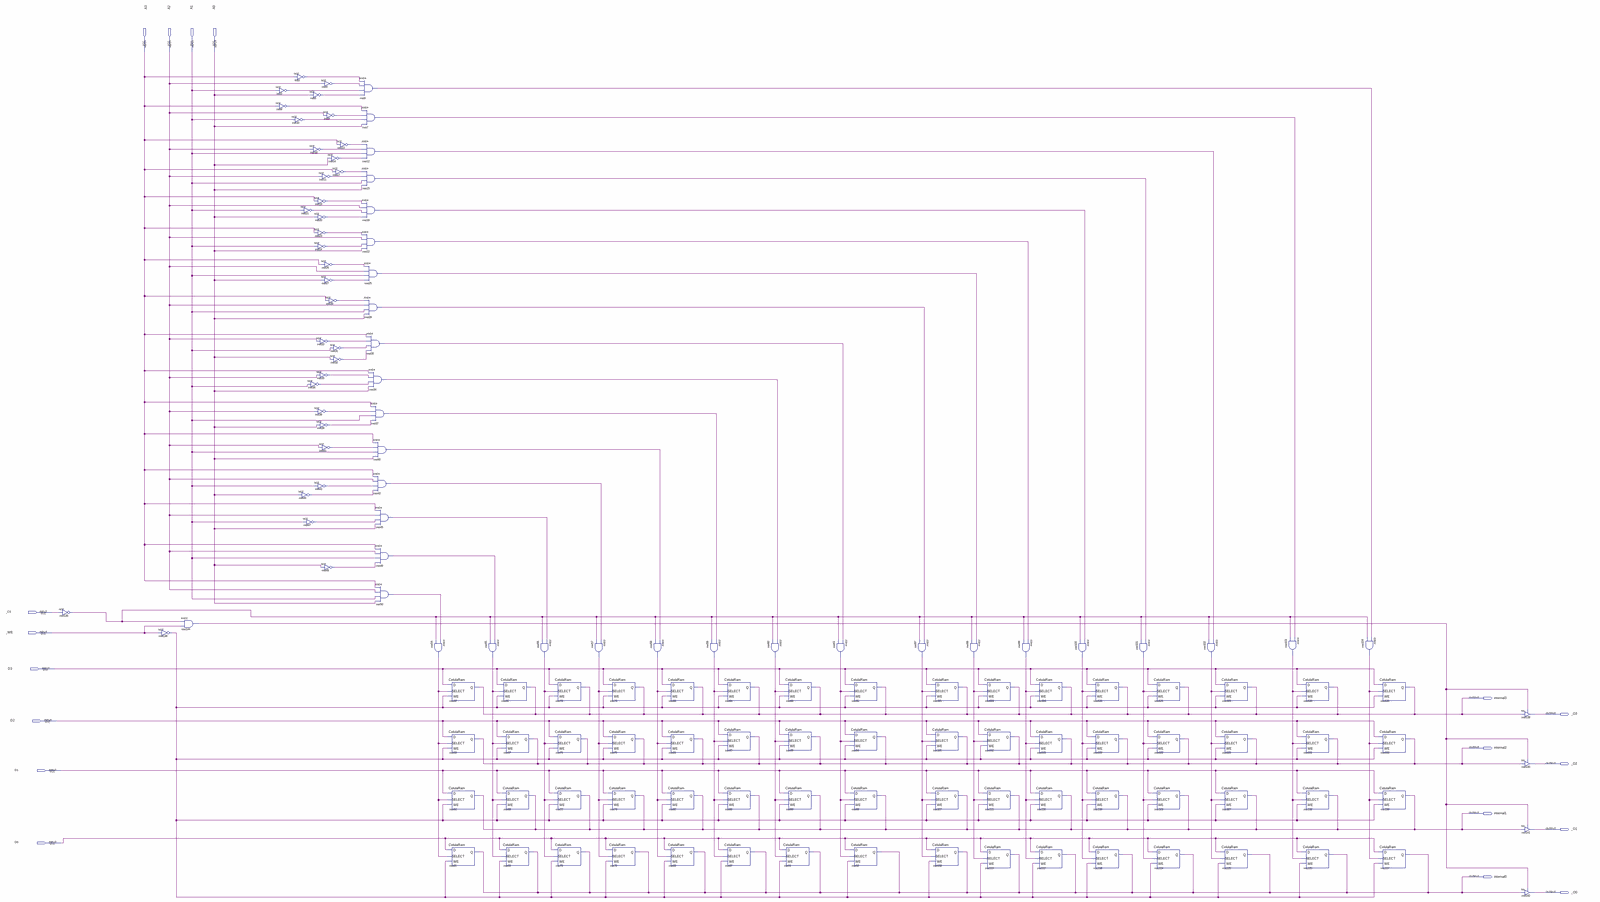
[diagram p0: schematic sheet, whole]
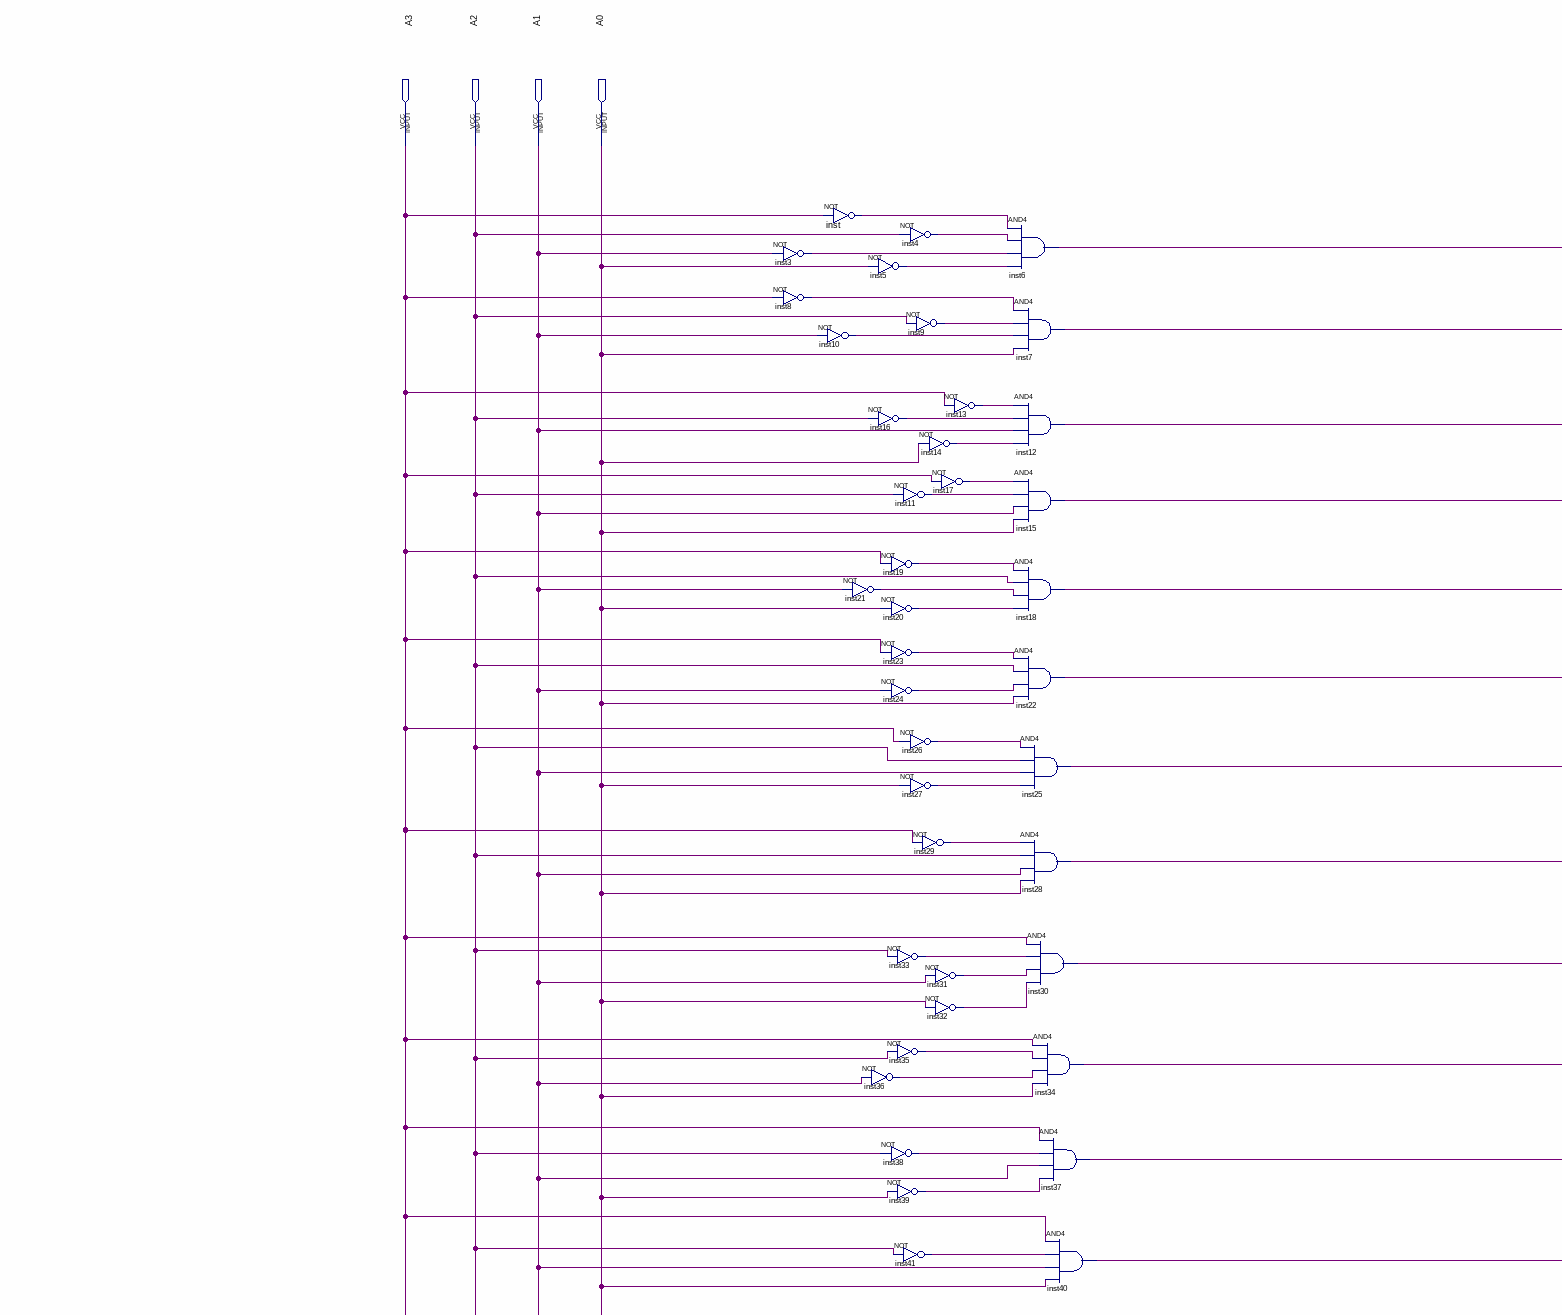
[diagram p1: schematic sheet, upper left part]
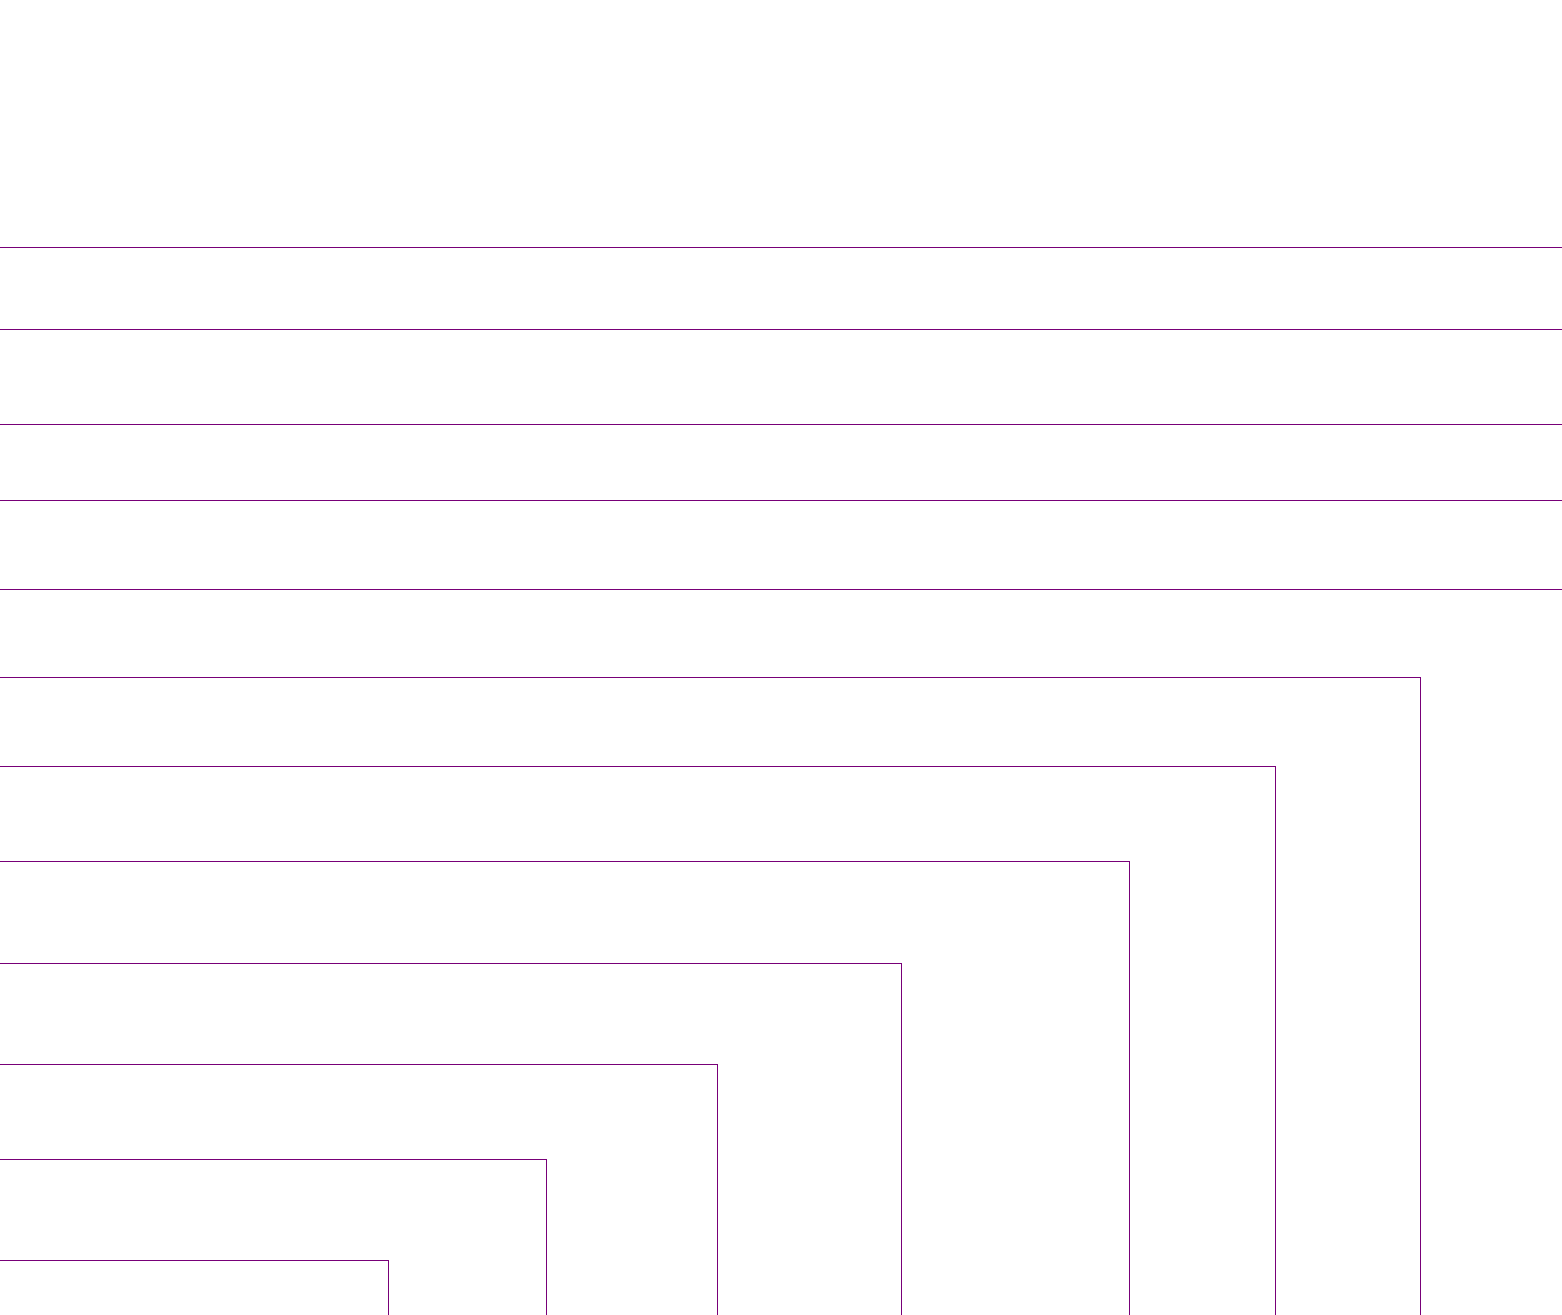
[diagram p2: schematic sheet, upper centre part]
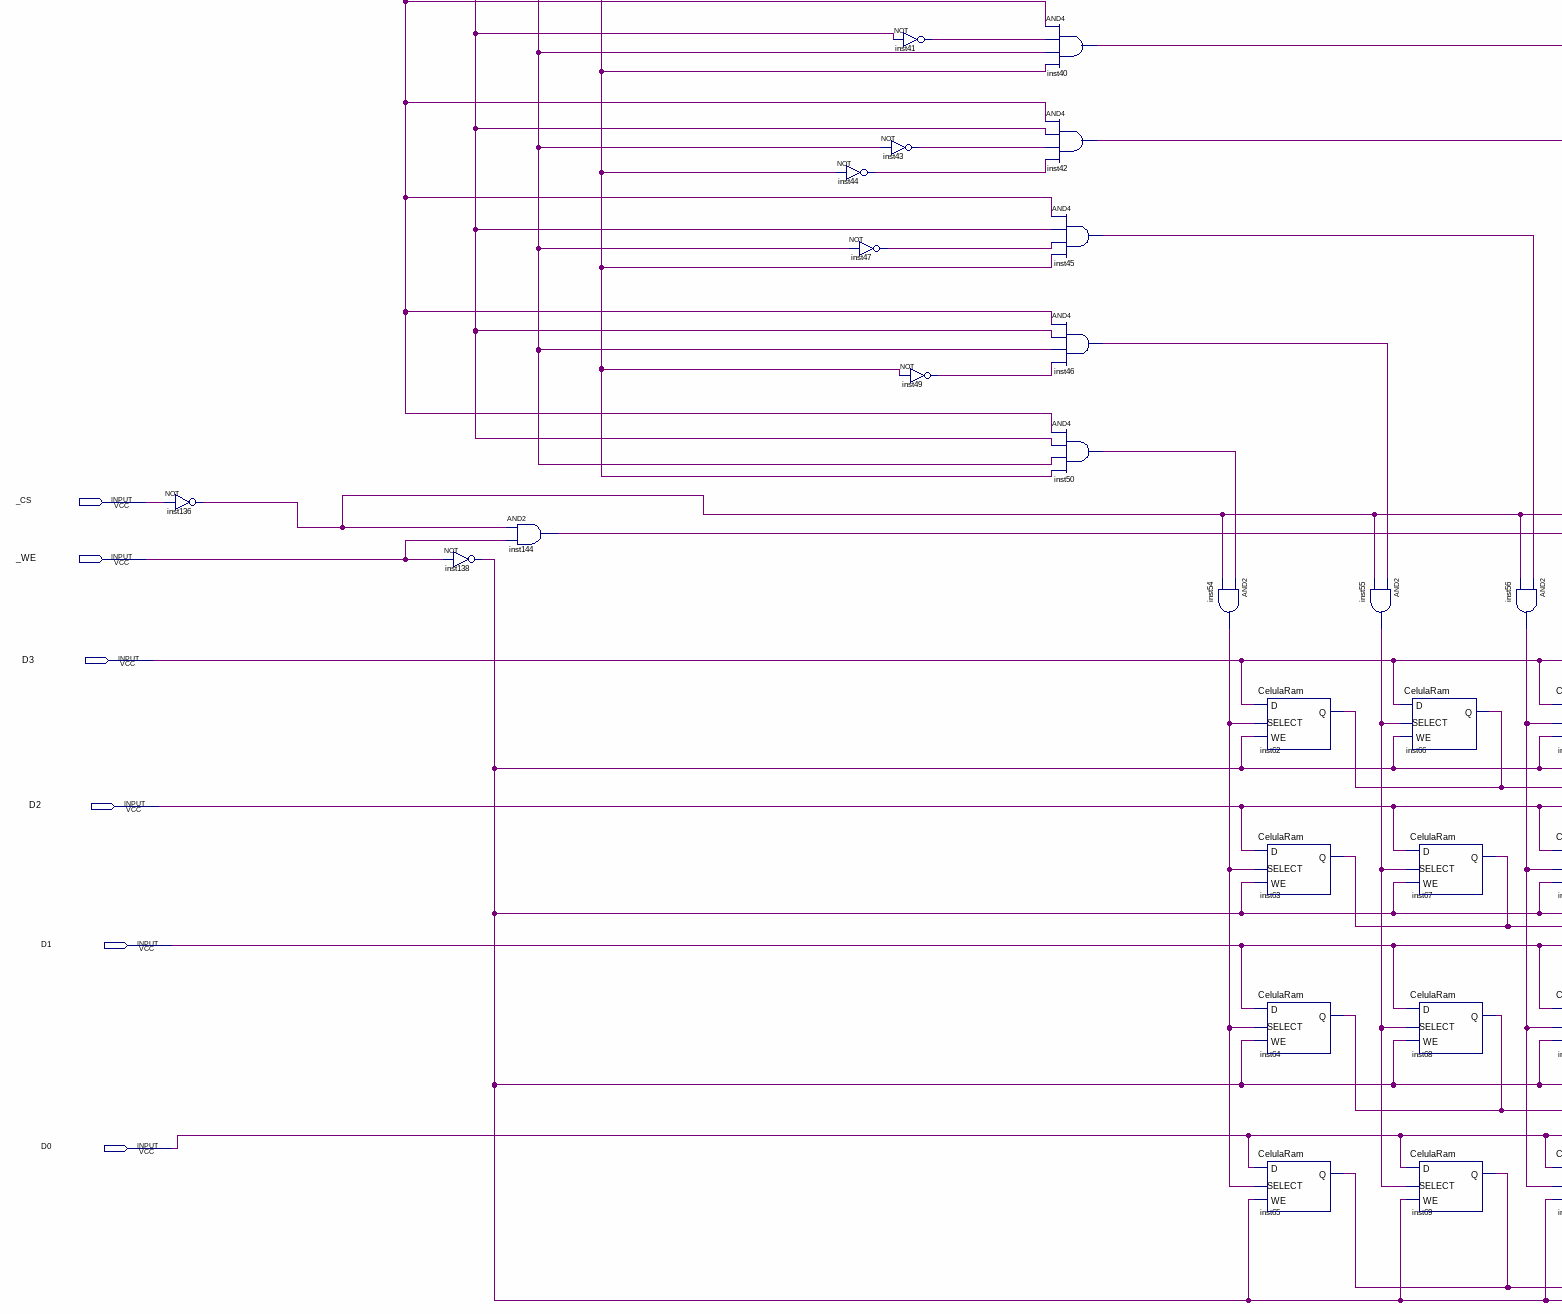
[diagram p3: schematic sheet, lower left part]
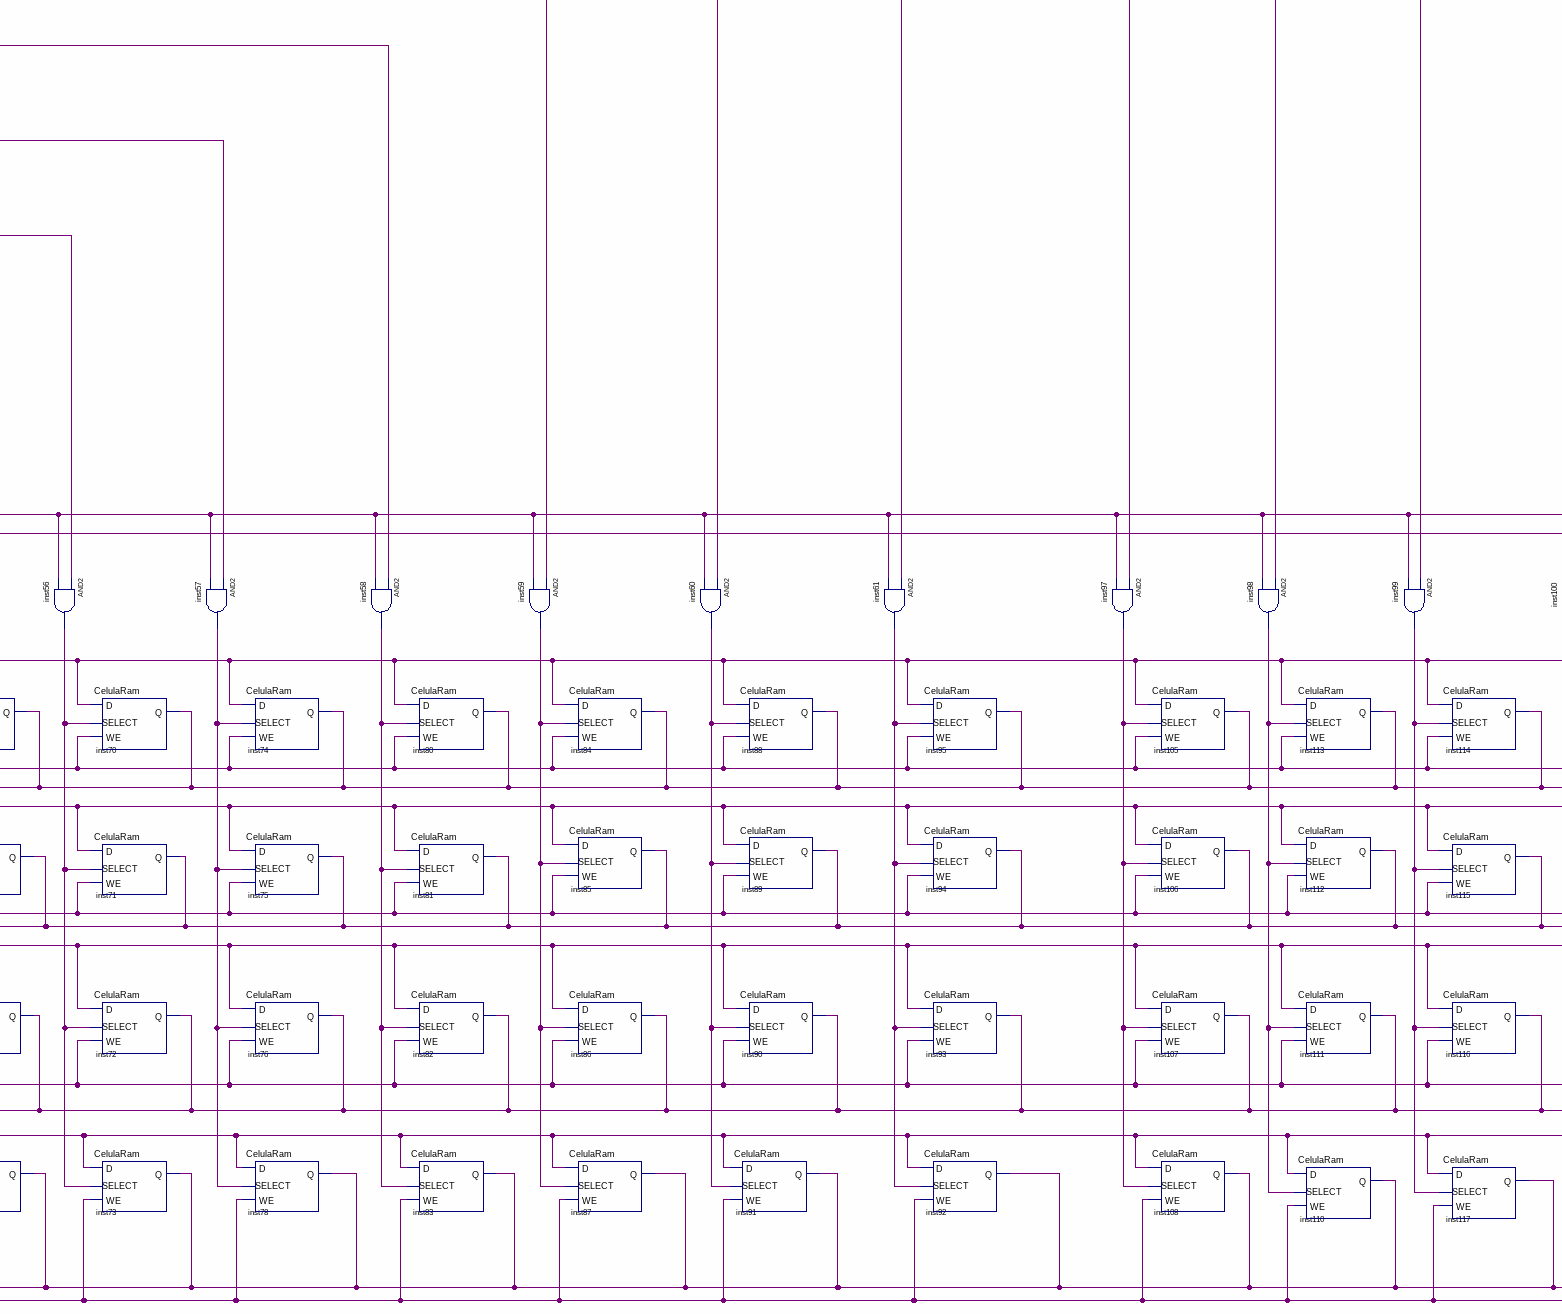
[diagram p4: schematic sheet, lower centre part]
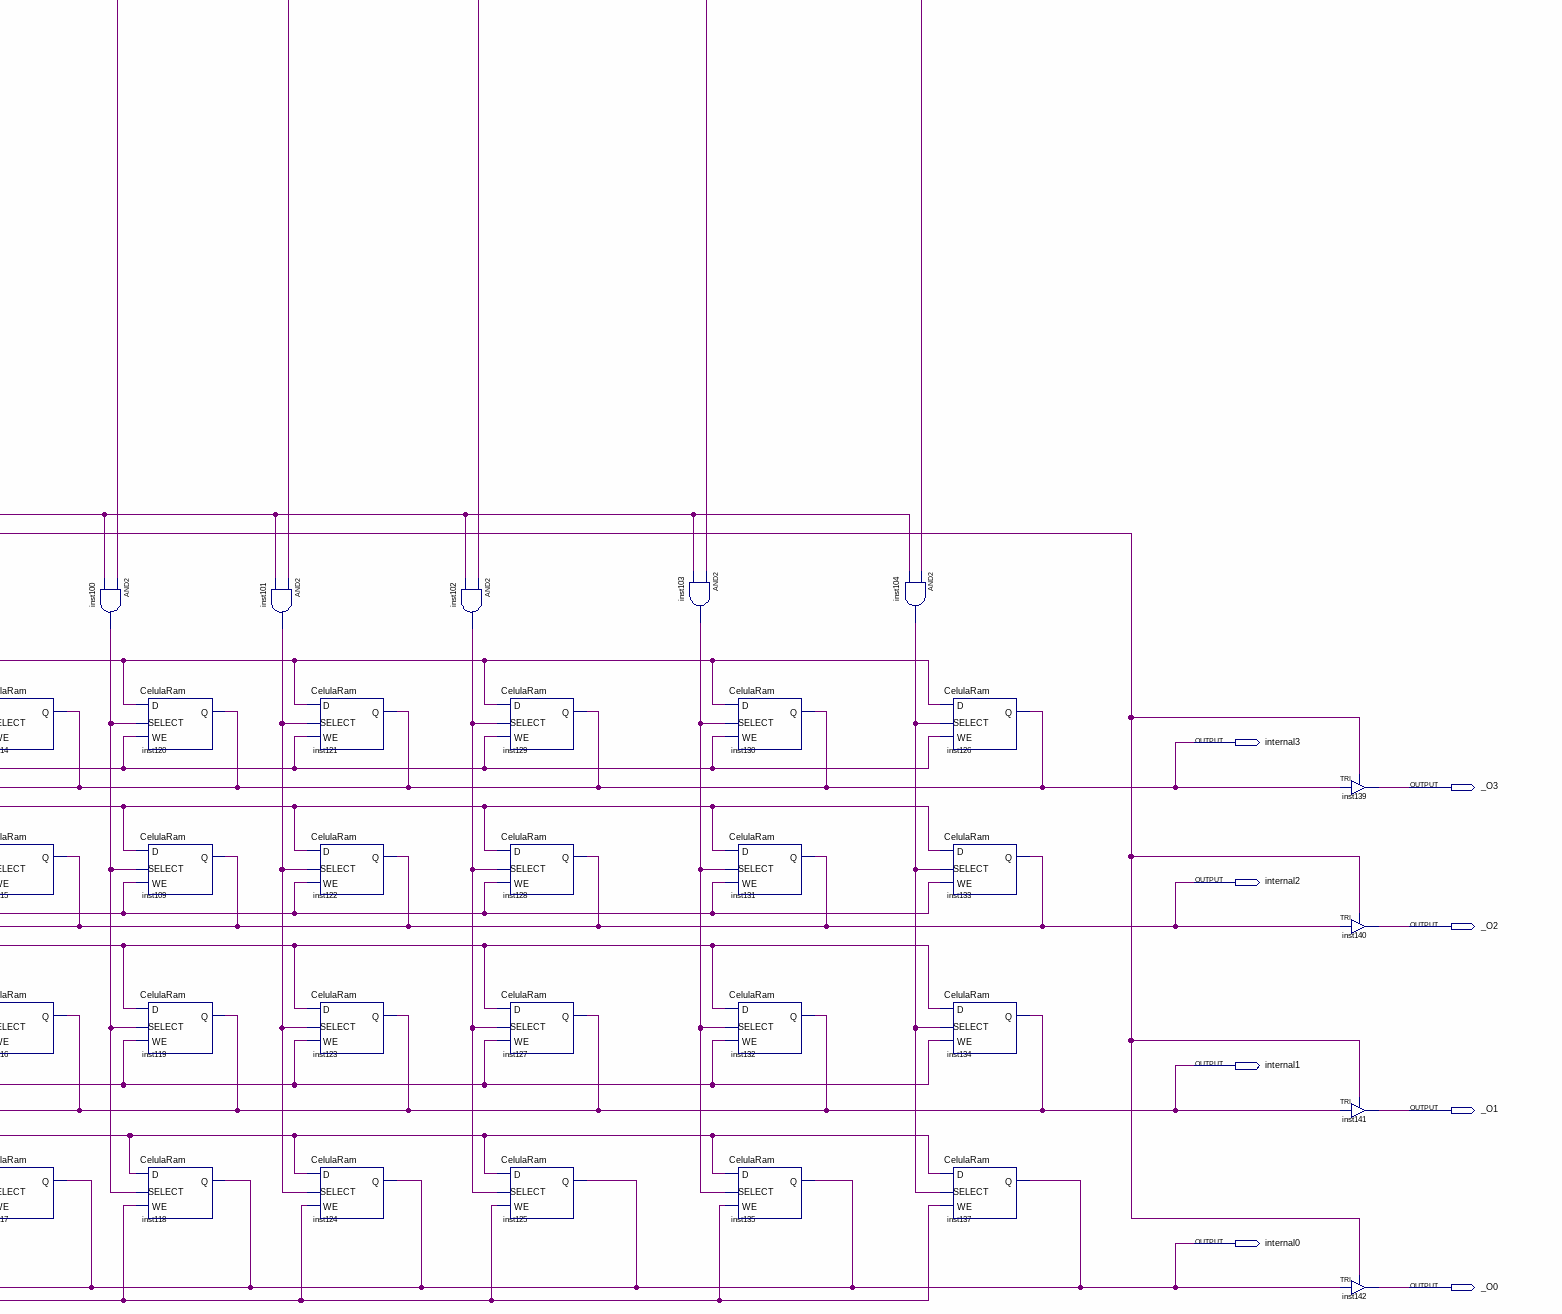
[diagram p5: schematic sheet, lower right part]
// Quartus schematic RAM.bdf as structural Verilog: 135 symbols, 18 pins
module RAM (
  input  A3,
  input  A2,
  input  A1,
  input  A0,
  input  _CS,
  input  _WE,
  input  D3,
  input  D2,
  input  D1,
  input  D0,
  output internal3,
  output _O3,
  output internal2,
  output _O2,
  output internal1,
  output _O1,
  output internal0,
  output _O0
);

  wire inst3_out, inst4_out, inst5_out, inst6_out, inst7_out, inst8_out, inst9_out, inst10_out, inst11_out,
       inst12_out, inst13_out, inst14_out, inst15_out, inst16_out, inst17_out, inst18_out, inst19_out,
       inst20_out, inst21_out, inst22_out, inst23_out, inst24_out, inst25_out, inst26_out, inst27_out,
       inst28_out, inst29_out, inst30_out, inst31_out, inst32_out, inst33_out, inst34_out, inst35_out,
       inst36_out, inst37_out, inst38_out, inst39_out, inst40_out, inst41_out, inst42_out, inst43_out,
       inst44_out, inst45_out, inst46_out, inst47_out, inst49_out, inst50_out, inst54_out, inst55_out,
       inst56_out, inst57_out, inst58_out, inst59_out, inst60_out, inst61_out, inst97_out, inst98_out,
       inst99_out, inst100_out, inst101_out, inst102_out, inst103_out, inst104_out, inst136_out, inst138_out,
       inst144_out, inst_out;

  not inst136 (inst136_out, _CS);
  not inst138 (inst138_out, _WE);
  and inst144 (inst144_out, inst136_out, _WE);
  not inst3 (inst3_out, A1);
  not inst8 (inst8_out, A3);
  not inst (inst_out, A3);
  not inst10 (inst10_out, A1);
  not inst5 (inst5_out, A0);
  not inst16 (inst16_out, A2);
  not inst21 (inst21_out, A1);
  not inst36 (inst36_out, A1);
  not inst44 (inst44_out, A0);
  not inst47 (inst47_out, A1);
  not inst4 (inst4_out, A2);
  not inst9 (inst9_out, A2);
  not inst14 (inst14_out, A0);
  not inst11 (inst11_out, A2);
  not inst19 (inst19_out, A3);
  not inst20 (inst20_out, A0);
  not inst23 (inst23_out, A3);
  not inst24 (inst24_out, A1);
  not inst26 (inst26_out, A3);
  not inst27 (inst27_out, A0);
  not inst29 (inst29_out, A3);
  not inst33 (inst33_out, A2);
  not inst31 (inst31_out, A1);
  not inst32 (inst32_out, A0);
  not inst35 (inst35_out, A2);
  not inst38 (inst38_out, A2);
  not inst39 (inst39_out, A0);
  not inst41 (inst41_out, A2);
  not inst43 (inst43_out, A1);
  not inst49 (inst49_out, A0);
  not inst13 (inst13_out, A3);
  not inst17 (inst17_out, A3);
  and inst6 (inst6_out, inst_out, inst4_out, inst3_out, inst5_out);
  and inst7 (inst7_out, inst8_out, inst9_out, inst10_out, A0);
  and inst12 (inst12_out, inst13_out, inst16_out, A1, inst14_out);
  and inst15 (inst15_out, inst17_out, inst11_out, A1, A0);
  and inst18 (inst18_out, inst19_out, A2, inst21_out, inst20_out);
  and inst22 (inst22_out, inst23_out, A2, inst24_out, A0);
  and inst25 (inst25_out, inst26_out, A2, A1, inst27_out);
  and inst28 (inst28_out, inst29_out, A2, A1, A0);
  and inst30 (inst30_out, A3, inst33_out, inst31_out, inst32_out);
  and inst34 (inst34_out, A3, inst35_out, inst36_out, A0);
  and inst37 (inst37_out, A3, inst38_out, A1, inst39_out);
  and inst40 (inst40_out, A3, inst41_out, A1, A0);
  and inst42 (inst42_out, A3, A2, inst43_out, inst44_out);
  and inst45 (inst45_out, A3, A2, inst47_out, A0);
  and inst46 (inst46_out, A3, A2, A1, inst49_out);
  and inst50 (inst50_out, A3, A2, A1, A0);
  and inst54 (inst54_out, inst50_out, inst136_out);
  CelulaRam inst62 (.WE(inst138_out), .SELECT(inst54_out), .D(D3), .Q(internal3));
  CelulaRam inst63 (.WE(inst138_out), .SELECT(inst54_out), .D(D2), .Q(internal2));
  CelulaRam inst64 (.WE(inst138_out), .SELECT(inst54_out), .D(D1), .Q(internal1));
  CelulaRam inst65 (.WE(inst138_out), .SELECT(inst54_out), .D(D0), .Q(internal0));
  and inst55 (inst55_out, inst46_out, inst136_out);
  CelulaRam inst66 (.WE(inst138_out), .SELECT(inst55_out), .D(D3), .Q(internal3));
  CelulaRam inst67 (.WE(inst138_out), .SELECT(inst55_out), .D(D2), .Q(internal2));
  CelulaRam inst68 (.WE(inst138_out), .SELECT(inst55_out), .D(D1), .Q(internal1));
  CelulaRam inst69 (.WE(inst138_out), .SELECT(inst55_out), .D(D0), .Q(internal0));
  and inst56 (inst56_out, inst45_out, inst136_out);
  CelulaRam inst70 (.WE(inst138_out), .SELECT(inst56_out), .D(D3), .Q(internal3));
  CelulaRam inst71 (.WE(inst138_out), .SELECT(inst56_out), .D(D2), .Q(internal2));
  CelulaRam inst72 (.WE(inst138_out), .SELECT(inst56_out), .D(D1), .Q(internal1));
  CelulaRam inst73 (.WE(inst138_out), .SELECT(inst56_out), .D(D0), .Q(internal0));
  and inst57 (inst57_out, inst42_out, inst136_out);
  CelulaRam inst74 (.WE(inst138_out), .SELECT(inst57_out), .D(D3), .Q(internal3));
  CelulaRam inst75 (.WE(inst138_out), .SELECT(inst57_out), .D(D2), .Q(internal2));
  CelulaRam inst76 (.WE(inst138_out), .SELECT(inst57_out), .D(D1), .Q(internal1));
  CelulaRam inst78 (.WE(inst138_out), .SELECT(inst57_out), .D(D0), .Q(internal0));
  and inst58 (inst58_out, inst40_out, inst136_out);
  CelulaRam inst80 (.WE(inst138_out), .SELECT(inst58_out), .D(D3), .Q(internal3));
  CelulaRam inst81 (.WE(inst138_out), .SELECT(inst58_out), .D(D2), .Q(internal2));
  CelulaRam inst82 (.WE(inst138_out), .SELECT(inst58_out), .D(D1), .Q(internal1));
  CelulaRam inst83 (.WE(inst138_out), .SELECT(inst58_out), .D(D0), .Q(internal0));
  and inst59 (inst59_out, inst37_out, inst136_out);
  CelulaRam inst84 (.WE(inst138_out), .SELECT(inst59_out), .D(D3), .Q(internal3));
  CelulaRam inst85 (.WE(inst138_out), .SELECT(inst59_out), .D(D2), .Q(internal2));
  CelulaRam inst86 (.WE(inst138_out), .SELECT(inst59_out), .D(D1), .Q(internal1));
  CelulaRam inst87 (.WE(inst138_out), .SELECT(inst59_out), .D(D0), .Q(internal0));
  and inst60 (inst60_out, inst34_out, inst136_out);
  CelulaRam inst91 (.WE(inst138_out), .SELECT(inst60_out), .D(D0), .Q(internal0));
  CelulaRam inst88 (.WE(inst138_out), .SELECT(inst60_out), .D(D3), .Q(internal3));
  CelulaRam inst89 (.WE(inst138_out), .SELECT(inst60_out), .D(D2), .Q(internal2));
  CelulaRam inst90 (.WE(inst138_out), .SELECT(inst60_out), .D(D1), .Q(internal1));
  and inst61 (inst61_out, inst30_out, inst136_out);
  CelulaRam inst95 (.WE(inst138_out), .SELECT(inst61_out), .D(D3), .Q(internal3));
  CelulaRam inst94 (.WE(inst138_out), .SELECT(inst61_out), .D(D2), .Q(internal2));
  CelulaRam inst93 (.WE(inst138_out), .SELECT(inst61_out), .D(D1), .Q(internal1));
  CelulaRam inst92 (.WE(inst138_out), .SELECT(inst61_out), .D(D0), .Q(internal0));
  and inst97 (inst97_out, inst28_out, inst136_out);
  CelulaRam inst105 (.WE(inst138_out), .SELECT(inst97_out), .D(D3), .Q(internal3));
  CelulaRam inst106 (.WE(inst138_out), .SELECT(inst97_out), .D(D2), .Q(internal2));
  CelulaRam inst107 (.WE(inst138_out), .SELECT(inst97_out), .D(D1), .Q(internal1));
  CelulaRam inst108 (.WE(inst138_out), .SELECT(inst97_out), .D(D0), .Q(internal0));
  and inst98 (inst98_out, inst25_out, inst136_out);
  CelulaRam inst113 (.WE(inst138_out), .SELECT(inst98_out), .D(D3), .Q(internal3));
  CelulaRam inst112 (.WE(inst138_out), .SELECT(inst98_out), .D(D2), .Q(internal2));
  CelulaRam inst111 (.WE(inst138_out), .SELECT(inst98_out), .D(D1), .Q(internal1));
  CelulaRam inst110 (.WE(inst138_out), .SELECT(inst98_out), .D(D0), .Q(internal0));
  and inst99 (inst99_out, inst22_out, inst136_out);
  CelulaRam inst114 (.WE(inst138_out), .SELECT(inst99_out), .D(D3), .Q(internal3));
  CelulaRam inst115 (.WE(inst138_out), .SELECT(inst99_out), .D(D2), .Q(internal2));
  CelulaRam inst116 (.WE(inst138_out), .SELECT(inst99_out), .D(D1), .Q(internal1));
  CelulaRam inst117 (.WE(inst138_out), .SELECT(inst99_out), .D(D0), .Q(internal0));
  and inst100 (inst100_out, inst18_out, inst136_out);
  CelulaRam inst120 (.WE(inst138_out), .SELECT(inst100_out), .D(D3), .Q(internal3));
  CelulaRam inst109 (.WE(inst138_out), .SELECT(inst100_out), .D(D2), .Q(internal2));
  CelulaRam inst119 (.WE(inst138_out), .SELECT(inst100_out), .D(D1), .Q(internal1));
  CelulaRam inst118 (.WE(inst138_out), .SELECT(inst100_out), .D(D0), .Q(internal0));
  and inst101 (inst101_out, inst15_out, inst136_out);
  CelulaRam inst121 (.WE(inst138_out), .SELECT(inst101_out), .D(D3), .Q(internal3));
  CelulaRam inst122 (.WE(inst138_out), .SELECT(inst101_out), .D(D2), .Q(internal2));
  CelulaRam inst123 (.WE(inst138_out), .SELECT(inst101_out), .D(D1), .Q(internal1));
  CelulaRam inst124 (.WE(inst138_out), .SELECT(inst101_out), .D(D0), .Q(internal0));
  and inst102 (inst102_out, inst12_out, inst136_out);
  CelulaRam inst129 (.WE(inst138_out), .SELECT(inst102_out), .D(D3), .Q(internal3));
  CelulaRam inst128 (.WE(inst138_out), .SELECT(inst102_out), .D(D2), .Q(internal2));
  CelulaRam inst127 (.WE(inst138_out), .SELECT(inst102_out), .D(D1), .Q(internal1));
  CelulaRam inst125 (.WE(inst138_out), .SELECT(inst102_out), .D(D0), .Q(internal0));
  and inst103 (inst103_out, inst7_out, inst136_out);
  CelulaRam inst130 (.WE(inst138_out), .SELECT(inst103_out), .D(D3), .Q(internal3));
  CelulaRam inst131 (.WE(inst138_out), .SELECT(inst103_out), .D(D2), .Q(internal2));
  CelulaRam inst132 (.WE(inst138_out), .SELECT(inst103_out), .D(D1), .Q(internal1));
  CelulaRam inst135 (.WE(inst138_out), .SELECT(inst103_out), .D(D0), .Q(internal0));
  and inst104 (inst104_out, inst6_out, inst136_out);
  CelulaRam inst126 (.WE(inst138_out), .SELECT(inst104_out), .D(D3), .Q(internal3));
  CelulaRam inst133 (.WE(inst138_out), .SELECT(inst104_out), .D(D2), .Q(internal2));
  CelulaRam inst134 (.WE(inst138_out), .SELECT(inst104_out), .D(D1), .Q(internal1));
  CelulaRam inst137 (.WE(inst138_out), .SELECT(inst104_out), .D(D0), .Q(internal0));
  TRI inst139 (.IN(internal3), .OE(inst144_out), .OUT(_O3));
  TRI inst140 (.IN(internal2), .OE(inst144_out), .OUT(_O2));
  TRI inst141 (.IN(internal1), .OE(inst144_out), .OUT(_O1));
  TRI inst142 (.IN(internal0), .OE(inst144_out), .OUT(_O0));
endmodule
